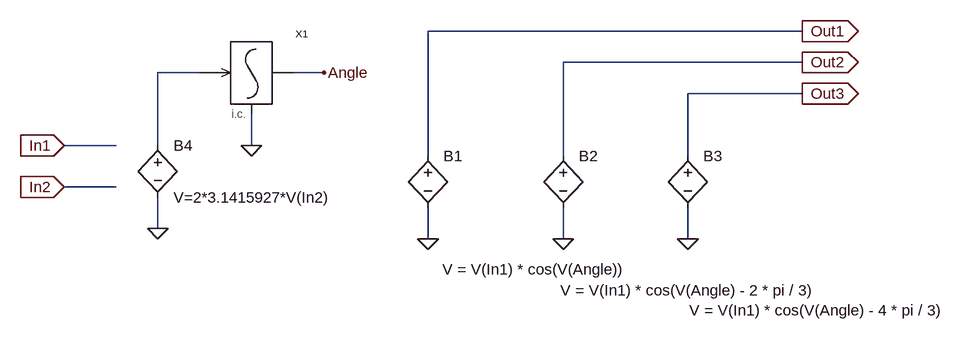
[diagram p0: schematic V-Hz.asc]
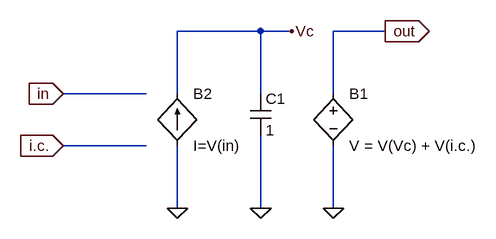
[diagram p1: sub-circuit integrator.asc]
V-Hz.asc, the LTspice schematic file:
Version 4
SHEET 1 2072 680
WIRE 1120 96 544 96
WIRE 1120 144 752 144
WIRE 192 160 128 160
WIRE 384 160 336 160
WIRE 1120 192 944 192
WIRE 64 272 -16 272
WIRE 128 272 128 160
WIRE 272 272 272 224
WIRE 544 288 544 96
WIRE 752 288 752 144
WIRE 944 288 944 192
WIRE 64 336 -16 336
WIRE 128 400 128 352
WIRE 544 416 544 368
WIRE 752 416 752 368
WIRE 944 416 944 368
FLAG -16 272 In1
IOPIN -16 272 In
FLAG -16 336 In2
IOPIN -16 336 In
FLAG 544 416 0
FLAG 752 416 0
FLAG 944 416 0
FLAG 1120 96 Out1
IOPIN 1120 96 Out
FLAG 1120 144 Out2
IOPIN 1120 144 Out
FLAG 1120 192 Out3
IOPIN 1120 192 Out
FLAG 128 400 0
FLAG 272 272 0
FLAG 384 160 Angle
SYMBOL bv 544 272 R0
WINDOW 3 22 191 Left 0
SYMATTR Value V = V(In1) * cos(V(Angle))
SYMATTR InstName B1
SYMBOL bv 752 272 R0
WINDOW 3 -4 223 Left 0
SYMATTR Value V = V(In1) * cos(V(Angle) - 2 * pi / 3)
SYMATTR InstName B2
SYMBOL bv 944 272 R0
WINDOW 3 2 254 Left 0
SYMATTR Value V = V(In1) * cos(V(Angle) - 4 * pi / 3)
SYMATTR InstName B3
SYMBOL bv 128 256 R0
SYMATTR InstName B4
SYMATTR Value V=2*3.1415927*V(In2)
SYMBOL Integrator 272 160 R0
SYMATTR InstName X1

integrator.asc, the sub-circuit schematic file:
Version 4
SHEET 1 880 680
WIRE 320 32 192 32
WIRE 368 32 320 32
WIRE 512 32 432 32
WIRE 144 128 16 128
WIRE 192 128 192 32
WIRE 320 128 320 32
WIRE 432 128 432 32
WIRE 144 208 16 208
WIRE 192 304 192 208
WIRE 320 304 320 192
WIRE 432 304 432 208
FLAG 16 128 in
IOPIN 16 128 In
FLAG 432 304 0
FLAG 512 32 out
IOPIN 512 32 Out
FLAG 192 304 0
FLAG 320 304 0
FLAG 368 32 Vc
FLAG 16 208 i.c.
IOPIN 16 208 In
SYMBOL bv 432 112 R0
SYMATTR InstName B1
SYMATTR Value V = V(Vc) + V(i.c.)
SYMBOL bi2 192 128 R0
SYMATTR InstName B2
SYMATTR Value I=V(in)
SYMBOL cap 304 128 R0
SYMATTR InstName C1
SYMATTR Value 1

The netlist it stands for:
* V-Hz.asc
B1 Out1 0 V = V(In1) * cos(V(Angle))
B2 Out2 0 V = V(In1) * cos(V(Angle) - 2 * pi / 3)
B3 Out3 0 V = V(In1) * cos(V(Angle) - 4 * pi / 3)
B4 N001 0 V=2*3.1415927*V(In2)
XX1 N001 Angle 0 integrator

* block symbol definitions
.subckt integrator in out i.c.
B1 out 0 V = V(Vc) + V(i.c.)
B2 0 Vc I=V(in)
C1 Vc 0 1
.ends integrator

.backanno
.end